# Altium schematic sheet EntradaSensores.SchDoc: CONTROLADORA AIRPOPCORN
size A3; DocumentNumber: 10.00.0025; SheetNumber: 6; SheetTotal: 16
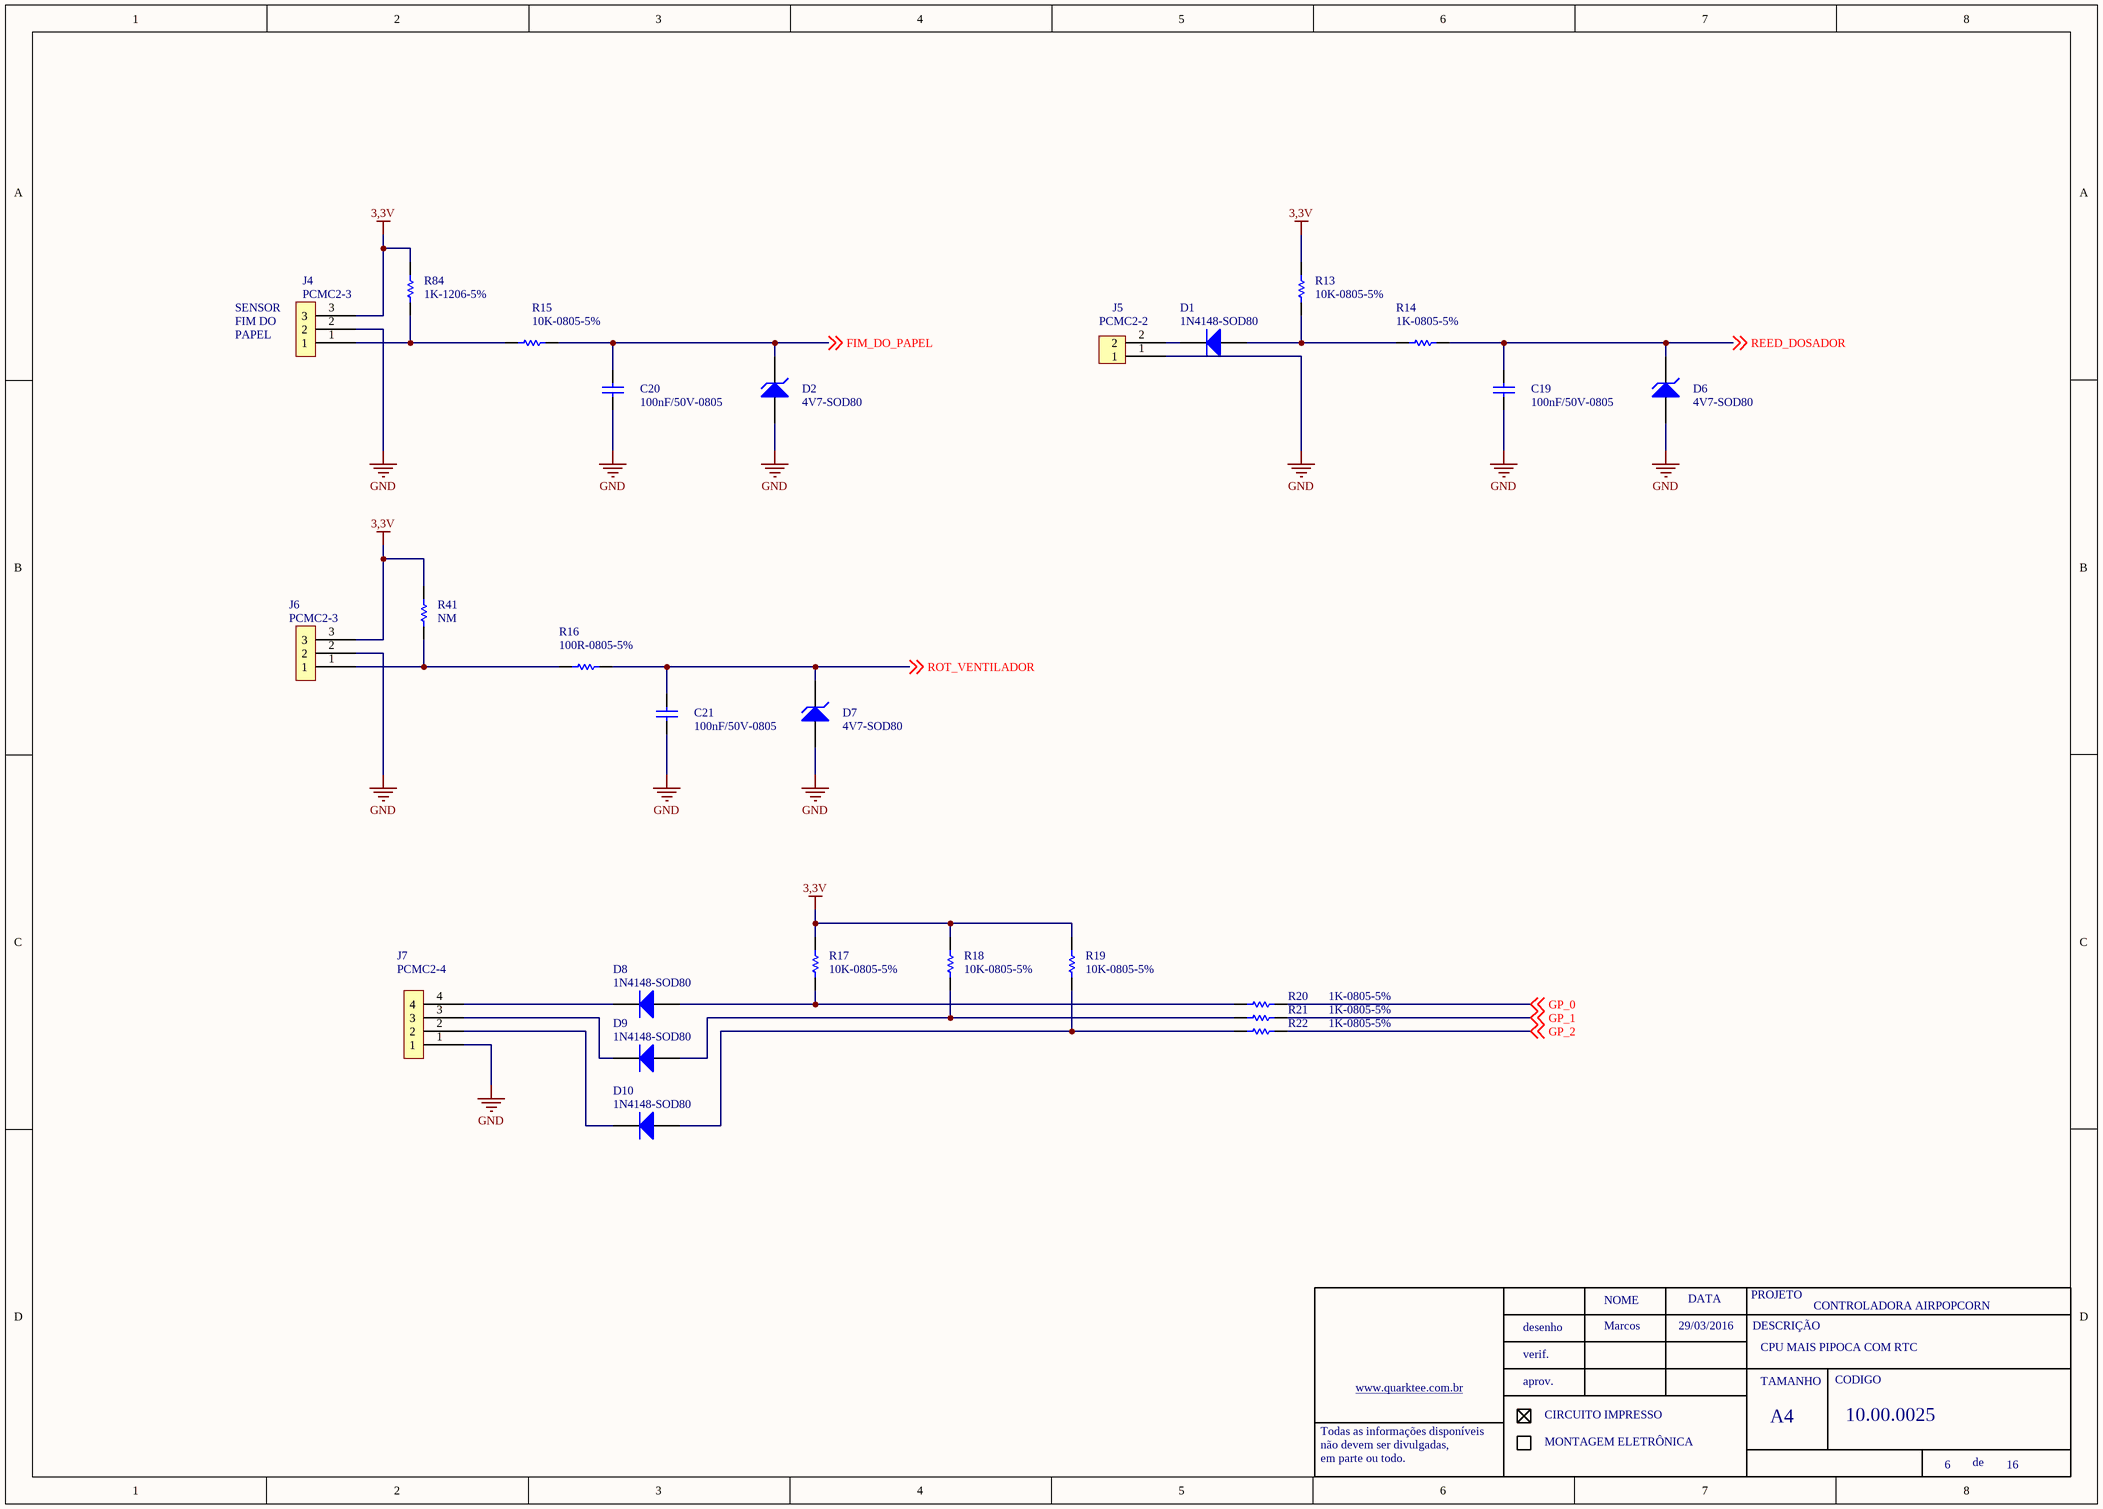
[diagram p0: EntradaSensores.SchDoc]

## Parts
C19  100nF/50V-0805  [0805-REVISADO O]
C20  100nF/50V-0805  [0805-REVISADO O]
C21  100nF/50V-0805  [0805-REVISADO O]
D1  1N4148-SOD80  [MINIMLEF/SOD80]
D2  4V7-SOD80  [MINIMLEF/SOD80]
D6  4V7-SOD80  [MINIMLEF/SOD80]
D7  4V7-SOD80  [MINIMLEF/SOD80]
D8  1N4148-SOD80  [MINIMLEF/SOD80]
D9  1N4148-SOD80  [MINIMLEF/SOD80]
D10  1N4148-SOD80  [MINIMLEF/SOD80]
J4  PCMC2-3  [PCMC2-3]
J5  PCMC2-2  [PCMC2-2]
J6  PCMC2-3  [PCMC2-3]
J7  PCMC2-4  [PCMC2-4]
R13  10K-0805-5%  [0805-REVISADO O]
R14  1K-0805-5%  [0805-REVISADO O]
R15  10K-0805-5%  [0805-REVISADO O]
R16  100R-0805-5%  [0805-REVISADO O]
R17  10K-0805-5%  [0805-REVISADO O]
R18  10K-0805-5%  [0805-REVISADO O]
R19  10K-0805-5%  [0805-REVISADO O]
R20  1K-0805-5%  [0805-REVISADO O]
R21  1K-0805-5%  [0805-REVISADO O]
R22  1K-0805-5%  [0805-REVISADO O]
R41  NM  [0805-REVISADO O]
R84  1K-1206-5%  [1206-REVISADO O]

## Nets
3,3V: J4.3 J6.3 R13.2 R17.2 R18.2 R19.2 R41.2 R84.2
GND: C19.1 C20.1 C21.1 D2.1(A) D6.1(A) D7.1(A) J4.2 J5.1 J6.2 J7.1
FIM_DO_PAPEL: C20.2 D2.2(K) R15.2 ; off-sheet FIM_DO_PAPEL
GP_0: R20.2 ; off-sheet GP_0
GP_1: R21.2 ; off-sheet GP_1
GP_2: R22.2 ; off-sheet GP_2
REED_DOSADOR: C19.2 D6.2(K) R14.2 ; off-sheet REED_DOSADOR
ROT_VENTILADOR: C21.2 D7.2(K) R16.2 ; off-sheet ROT_VENTILADOR
NetD1_1: D1.1 R13.1 R14.1
NetD1_2: D1.2 J5.2
NetD8_1: D8.1 R17.1 R20.1
NetD8_2: D8.2 J7.4
NetD9_1: D9.1 R18.1 R21.1
NetD9_2: D9.2 J7.3
NetD10_1: D10.1 R19.1 R22.1
NetD10_2: D10.2 J7.2
NetJ4_1: J4.1 R15.1 R84.1
NetJ6_1: J6.1 R16.1 R41.1

## Notes on the sheet
- (near J4) SENSOR
- (near J4) FIM DO
- (near J4) PAPEL
- Marcos
- 29/03/2016
- CPU MAIS PIPOCA COM RTC
- NOME
- DATA
- PROJETO
- DESCRIÇÃO
- www.quarktee.com.br
- desenho
- verif.
- aprov.
- TAMANHO
- CODIGO
- Todas as informações disponíveis
- não devem ser divulgadas,
- em parte ou todo.
- CIRCUITO IMPRESSO
- MONTAGEM ELETRÔNICA
- A4
- de

## Library data of the parts
C19 C20 = 100nF/50-0805-NPO: ERP: 104.11.005
C21 = 10nF/50V-0805-NPO: ERP: 104.11.004
D2 D6 D7 = ZENER 3V3-SOD80: 3V3-SOD80-1/2W; ERP: 120.19.005
R15 R16 R41 = 100K-0805-5%: ERP: 102.11.066
R20-R22 = 10K-0805-5%: ERP: 102.11.054
R84 = 1K-0805-5%: ERP: 102.11.042
D1 D8-D10 = 1N4148-SOD80: ERP: 120.19.001
R13 R17-R19 = 10K-0805-5%: ERP: 102.11.054
R14 = 1K-0805-5%: ERP: 102.11.042